# EAGLE schematic RC_tiny85 (EAGLE 9.0.0)
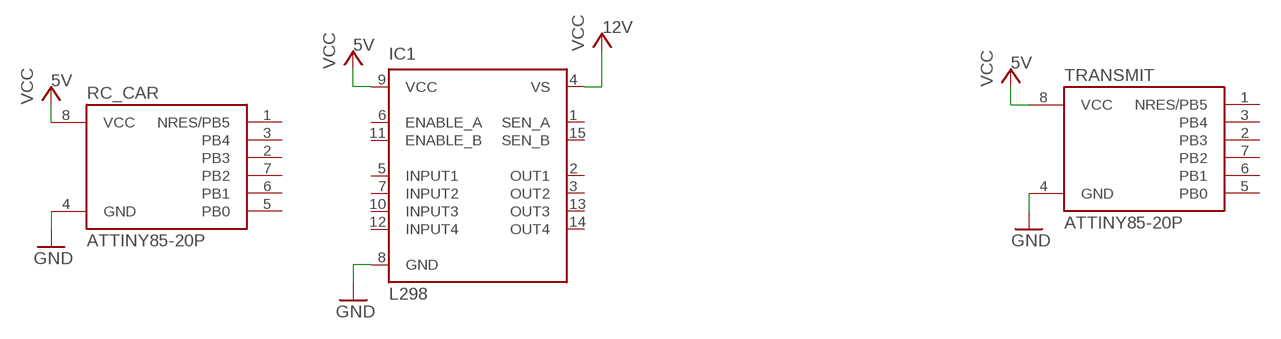
[diagram p0: schematic, sheet 1]

## Parts
IC1  L298  [MULTIWATT-15]
RC_CAR  ATTINY85-20P  [PDIP08_300MIL]
TRANSMIT  ATTINY85-20P  [PDIP08_300MIL]

## Nets
GND: IC1.8(GND) RC_CAR.4(GND)
VCC: IC1.4(VS) IC1.9(VCC) RC_CAR.8(VCC) TRANSMIT.8(VCC)
Unconnected: IC1.1(SEN_A) IC1.2(OUT1) IC1.3(OUT2) IC1.5(INPUT1) IC1.6(ENABLE_A) IC1.7(INPUT2) IC1.10(INPUT3) IC1.11(ENABLE_B) IC1.12(INPUT4) IC1.13(OUT3) IC1.14(OUT4) IC1.15(SEN_B) RC_CAR.1(NRES/PB5) RC_CAR.2(PB3) RC_CAR.3(PB4) RC_CAR.5(PB0) RC_CAR.6(PB1) RC_CAR.7(PB2) TRANSMIT.1(NRES/PB5) TRANSMIT.2(PB3) TRANSMIT.3(PB4) TRANSMIT.5(PB0) TRANSMIT.6(PB1) TRANSMIT.7(PB2)

## Power pins joined to a net without a drawn wire
GND: TRANSMIT.4(GND)

## Library data of the parts
IC1 = st-microelectronics:L298: DUAL FULL-BRIDGE DRIVER; MPN: L298N; OC_FARNELL: 1589425; OC_NEWARK: 32M1527
RC_CAR TRANSMIT = _hhn_attiny25_45_85:ATTINY85*: ATMEL ATtiny 85 Packages: P = PDIP 08 30mil S = SOIC 08 EIAJ 208mil Technologies Note: for complete ordering code (temp. range, finish, tape&reel etc.) see www.atmel.com • Supply Voltage: V = (1.8…5.5)V | [blank] = (2.7…5.5)V • Speed: 10 = 10 MHz | 20 = 20 MHz Author: Dipl.-Ing. FH Rainer Bayer HHN Hochschule Heilbronn (Heilbronn University), rainer.bayer@hs-heilbronn.de Ingenieurbüro ing-rb, mail@ing-rb.de